# Altium project PCB_Project1.PrjPCB
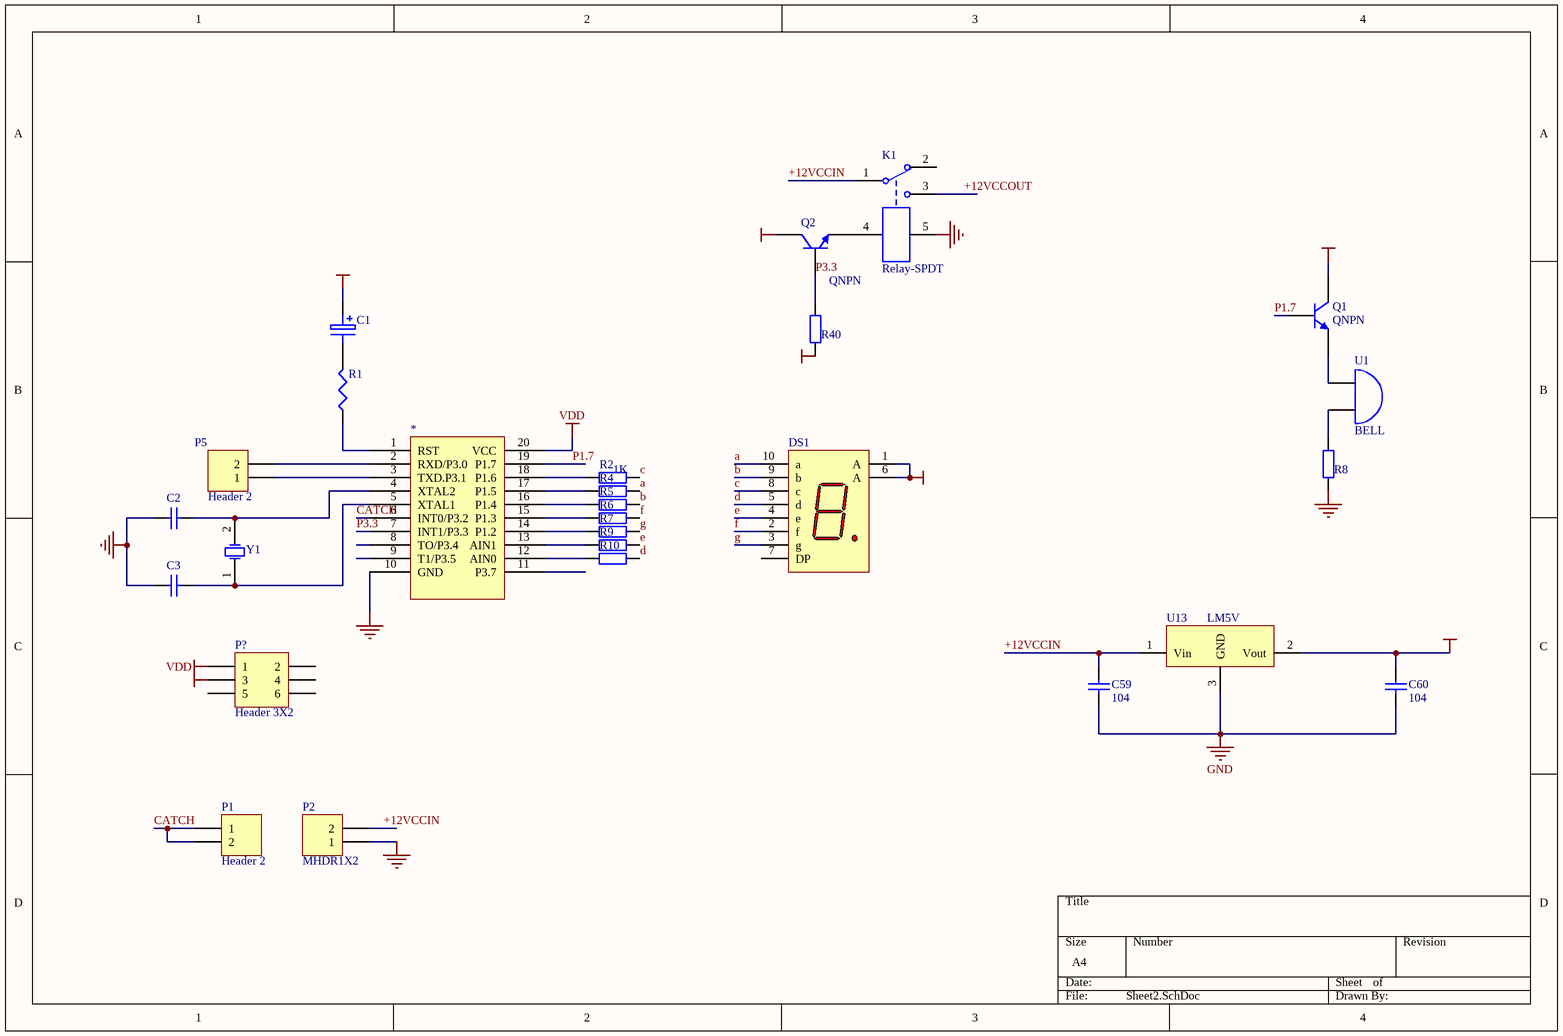
[diagram p0: Sheet2.SchDoc]
1 sheet, 27 parts. Net scope: global (net labels, ports and power ports of the same name join across sheets).
Board file: PCB2.PcbDoc

## Sheet Sheet2.SchDoc
size A4

### Parts
*  U?  [DIP20]  (value not drawn)
C1  ELECTRO1  [0805]  (value not drawn)
C2  Cap  [6-0805]  (value not drawn)
C3  Cap  [6-0805]  (value not drawn)
C59  value 104  [6-0805]  (hidden comment: Cap)
C60  value 104  [6-0805]  (hidden comment: Cap)
DS1  Dpy Red-CA  [LEDDIP-10]  (value not drawn)
K1  Relay-SPDT  [relay]
P1  Header 2  [HDR1X2]
P2  MHDR1X2  [HDR1X2]
P5  Header 2  [HDR1X2]
P?  Header 3X2  [PCBComponent_1]
Q1  QNPN  [9014]
Q2  QNPN  [9014]
R1  RES1  [0805]  (value not drawn)
R2  value 1K  [6-0805]  (hidden comment: Res2)
R4  Res2  [6-0805]  (value not drawn)
R5  Res2  [6-0805]  (value not drawn)
R6  Res2  [6-0805]  (value not drawn)
R7  Res2  [6-0805]  (value not drawn)
R8  Res2  [6-0805]  (value not drawn)
R9  Res2  [6-0805]  (value not drawn)
R10  Res2  [6-0805]  (value not drawn)
R40  Res2  [6-0805]  (value not drawn)
U1  BELL  [BUZZR]
U13  LM5V  [TO254P1543X460-3N_MC7805]
Y1  XTAL  [JZ]  (value not drawn)

### Nets
GND: *.10(GND) C2.1 C3.1 C59.1 C60.1 K1.5 P2.1 R8.1 U13.3(GND)
VCC: C1.1 C60.2 DS1.1(A) DS1.6(A) P?.3 Q1.1(C) Q2.1(C) R40.1 U13.2(Vout)
VDD: *.20(VCC) P?.1
+12VCCIN: C59.2 K1.1 P2.2 U13.1(Vin)
+12VCCOUT: K1.3
a: DS1.10(a) R4.2
b: DS1.9(b) R5.2
c: DS1.8(c) R2.2
CATCH: *.6(INT0/P3.2) P1.1 P1.2
d: DS1.5(d) R10.2
e: DS1.4(e) R9.2
f: DS1.2(f) R6.2
g: DS1.3(g) R7.2
P1.7: *.19(P1.7) Q1.2(B)
P3.3: *.7(INT1/P3.3) Q2.2(B) R40.2
Net*_1: *.1(RST) R1.1
Net*_2: *.2(RXD/P3.0) P5.2
Net*_3: *.3(TXD.P3.1) P5.1
Net*_4: *.4(XTAL2) C2.2 Y1.2(OSC2)
Net*_5: *.5(XTAL1) C3.2 Y1.1(OSC1)
Net*_12: *.12(AIN0) R10.1
Net*_13: *.13(AIN1) R9.1
Net*_14: *.14(P1.2) R7.1
Net*_15: *.15(P1.3) R6.1
Net*_16: *.16(P1.4) R5.1
Net*_17: *.17(P1.5) R4.1
Net*_18: *.18(P1.6) R2.1
NetC1_2: C1.2 R1.2
NetK1_4: K1.4 Q2.3(E)
NetQ1_3: Q1.3(E) U1.1(A)
NetR8_2: R8.2 U1.2(B)

Not connected (* = marked no-connect by the designer): * 8(TO/P3.4) 9(T1/P3.5) 11(P3.7); DS1 7(DP); K1 2; P? 2 4 5 6; U13 4(Vout)

### Library data of the parts
* = 2051
C1 = ELECTRO1: Electrolytic Capacitor
C2 C3 = Cap: Capacitor; Value: 100pF; Published: 8-Jun-2000; LatestRevisionDate: 17-Jul-2002; LatestRevisionNote: Re-released for DXP Platform.; PackageReference: RAD-0.3; Publisher: Altium Limited
C59 C60 = Cap: Capacitor; Published: 8-Jun-2000; LatestRevisionDate: 17-Jul-2002; LatestRevisionNote: Re-released for DXP Platform.; PackageReference: RAD-0.3; Publisher: Altium Limited
DS1 = Dpy Red-CA: 7.62 mm Black Surface HER 7-Segment Display: CA, RH DP; MinimumIntensity: 360 ucd; Note: IF = 5 mA; Colour: High Efficiency Red (HER); Note: Pins 1 and 6 are redundant Anodes.; Published: 8-Jun-2000; LatestRevisionDate: 17-Dec-2003; LatestRevisionNote: Schematic revised, PCB Footprint replaced.; DatasheetDocument: 19-Feb-2002; PackageDocument: 19-Feb-2002; PackageReference: LEDDIP-10; Publisher: Altium Limited; ComponentLink1Description: Manufacturer Link; ComponentLink1URL: http://www.agilent.com/
K1 = Relay-SPDT: Single-Pole Dual-Throw Relay; Published: 24-Mar-1999; LatestRevisionDate: 17-Jul-2002; LatestRevisionNote: Re-released for DXP Platform.; PackageReference: MODULE5B; Publisher: Altium Limited
P1 P5 = Header 2: Header, 2-Pin; LatestRevisionDate: 17-Jul-2002; LatestRevisionNote: Re-released for DXP Platform.; Publisher: Altium Limited
P2 = MHDR1X2: Header, 2-Pin; LatestRevisionDate: 17-Jul-2002; LatestRevisionNote: Re-released for DXP Platform.; Publisher: Altium Limited
P? = Header 3X2: Header, 3-Pin, Dual row; LatestRevisionDate: 17-Jul-2002; LatestRevisionNote: Re-released for DXP Platform.; Publisher: Altium Limited
Q1 Q2 = QNPN: NPN Bipolar Transistor; Published: 8-Jun-2000; LatestRevisionDate: 17-Jul-2002; LatestRevisionNote: Re-released for DXP Platform.; PackageReference: SOT-23B; Publisher: Altium Limited; Code_JEDEC: SOT-23
R2 = Res2: Resistor; Published: 8-Jun-2000; LatestRevisionDate: 17-Jul-2002; LatestRevisionNote: Re-released for DXP Platform.; PackageReference: AXIAL-0.4; Publisher: Altium Limited
R4-R10 R40 = Res2: Resistor; Value: 1K; Published: 8-Jun-2000; LatestRevisionDate: 17-Jul-2002; LatestRevisionNote: Re-released for DXP Platform.; PackageReference: AXIAL-0.4; Publisher: Altium Limited
U13 = LM1117-3.3V
Y1 = XTAL: Crystal Oscillator; Published: 8-Jun-2000; LatestRevisionDate: 17-Jul-2002; LatestRevisionNote: Re-released for DXP Platform.; PackageReference: R38; Publisher: Altium Limited